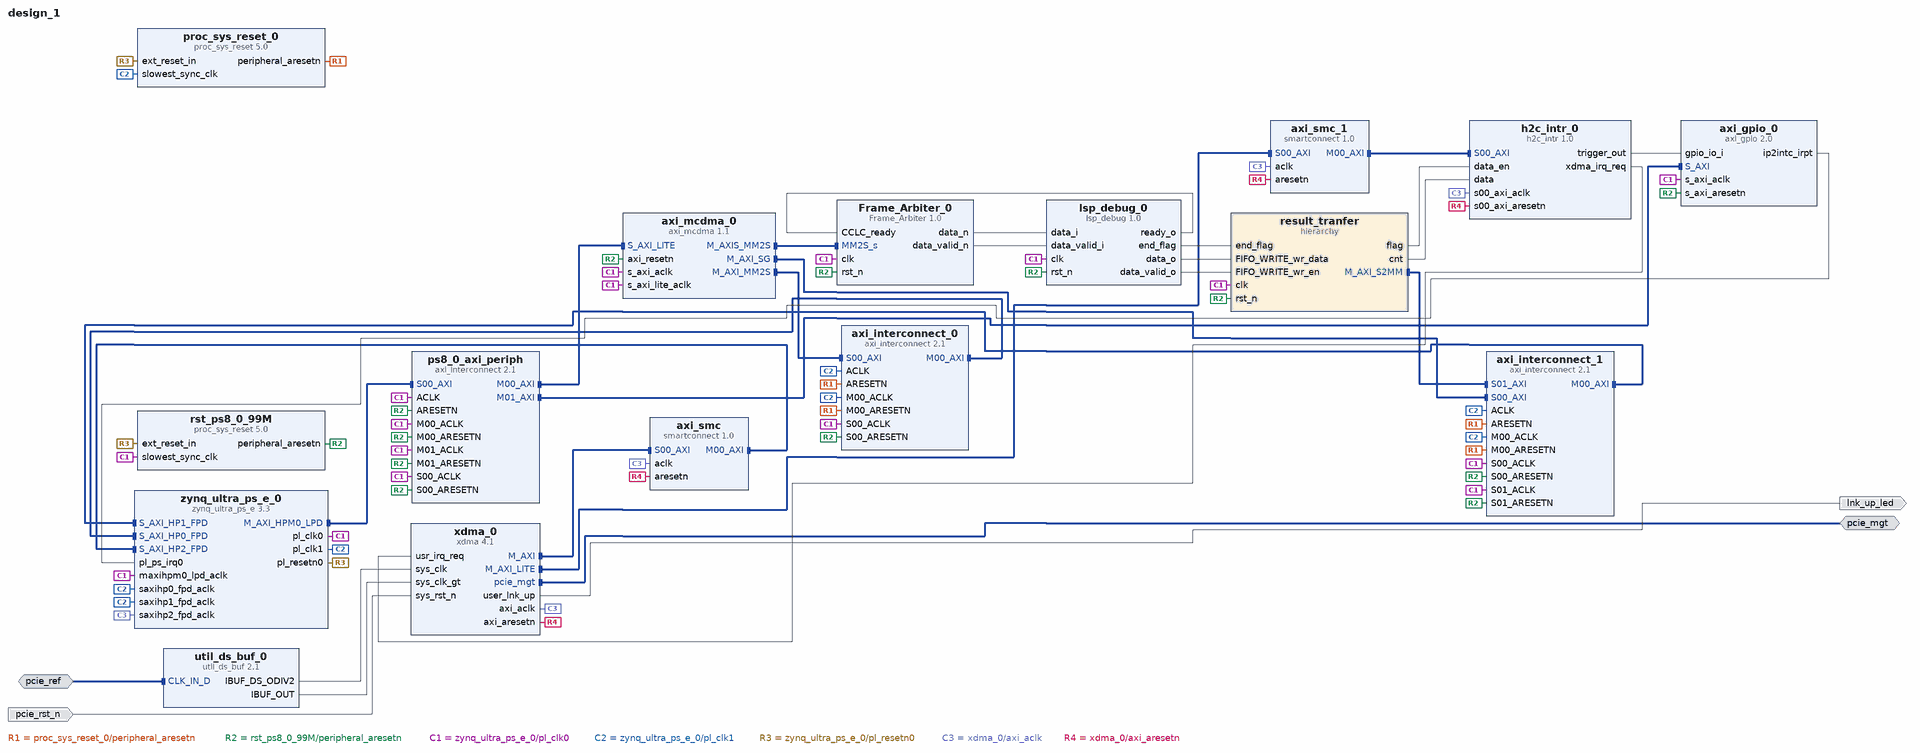
[diagram p0: block diagram of the top level]
# Vivado block design design_1, xczu4ev-sfvc784-2-i, Vivado 2020.2
create_bd_design design_1

create_bd_intf_port -mode Slave -vlnv xilinx.com:interface:diff_clock_rtl:1.0 pcie_ref
create_bd_intf_port -mode Master -vlnv xilinx.com:interface:pcie_7x_mgt_rtl:1.0 pcie_mgt
create_bd_port -dir I -type rst pcie_rst_n
create_bd_port -dir O lnk_up_led

create_bd_cell -type ip -vlnv xilinx.com:user:Frame_Arbiter:1.0 Frame_Arbiter_0
set_property -dict {CONFIG.channel_num 10} [get_bd_cells Frame_Arbiter_0]
create_bd_cell -type ip -vlnv xilinx.com:ip:axi_gpio:2.0 axi_gpio_0
set_property -dict [list \
  CONFIG.C_ALL_INPUTS 1 \
  CONFIG.C_ALL_INPUTS_2 0 \
  CONFIG.C_ALL_OUTPUTS_2 1 \
  CONFIG.C_GPIO2_WIDTH 1 \
  CONFIG.C_GPIO_WIDTH 1 \
  CONFIG.C_INTERRUPT_PRESENT 1 \
  CONFIG.C_IS_DUAL 1 \
] [get_bd_cells axi_gpio_0]
create_bd_cell -type ip -vlnv xilinx.com:ip:axi_interconnect:2.1 axi_interconnect_0
set_property -dict {CONFIG.NUM_MI 1 CONFIG.NUM_SI 1} [get_bd_cells axi_interconnect_0]
create_bd_cell -type ip -vlnv xilinx.com:ip:axi_interconnect:2.1 axi_interconnect_1
set_property -dict {CONFIG.NUM_MI 1 CONFIG.NUM_SI 2} [get_bd_cells axi_interconnect_1]
create_bd_cell -type ip -vlnv xilinx.com:ip:axi_mcdma:1.1 axi_mcdma_0
set_property -dict [list \
  CONFIG.c_group1_mm2s 0000001111111111 \
  CONFIG.c_include_s2mm 0 \
  CONFIG.c_m_axi_mm2s_data_width 256 \
  CONFIG.c_m_axis_mm2s_tdata_width 256 \
  CONFIG.c_mm2s_burst_size 32 \
  CONFIG.c_num_mm2s_channels 10 \
  CONFIG.c_sg_length_width 26 \
] [get_bd_cells axi_mcdma_0]
create_bd_cell -type ip -vlnv xilinx.com:user:lsp_debug:1.0 lsp_debug_0
set_property -dict {CONFIG.Height 582 CONFIG.Width 7680 CONFIG.merge_num 10} [get_bd_cells lsp_debug_0]
create_bd_cell -type ip -vlnv xilinx.com:ip:proc_sys_reset:5.0 proc_sys_reset_0
create_bd_cell -type ip -vlnv xilinx.com:ip:axi_interconnect:2.1 ps8_0_axi_periph
set_property -dict {CONFIG.NUM_MI 2} [get_bd_cells ps8_0_axi_periph]
create_bd_cell -type hier result_tranfer
create_bd_cell -type ip -vlnv xilinx.com:ip:proc_sys_reset:5.0 rst_ps8_0_99M
create_bd_cell -type ip -vlnv xilinx.com:ip:zynq_ultra_ps_e:3.3 zynq_ultra_ps_e_0
set_property -dict [list \
  CONFIG.PSU_BANK_0_IO_STANDARD LVCMOS18 \
  CONFIG.PSU_BANK_2_IO_STANDARD LVCMOS18 \
  CONFIG.PSU__CRF_APB__DDR_CTRL__FREQMHZ 1200 \
  CONFIG.PSU__CRF_APB__DDR_CTRL__SRCSEL DPLL \
  CONFIG.PSU__CRL_APB__PL0_REF_CTRL__FREQMHZ 200 \
  CONFIG.PSU__CRL_APB__PL0_REF_CTRL__SRCSEL IOPLL \
  CONFIG.PSU__CRL_APB__PL1_REF_CTRL__FREQMHZ 300 \
  CONFIG.PSU__CRL_APB__PL1_REF_CTRL__SRCSEL IOPLL \
  CONFIG.PSU__DDRC__BUS_WIDTH {64 Bit} \
  CONFIG.PSU__DDRC__COMPONENTS Components \
  CONFIG.PSU__DDRC__DEVICE_CAPACITY {8192 MBits} \
  CONFIG.PSU__DDRC__DRAM_WIDTH {16 Bits} \
  CONFIG.PSU__DDRC__ECC Disabled \
  CONFIG.PSU__DDRC__MEMORY_TYPE {DDR 4} \
  CONFIG.PSU__DDRC__SPEED_BIN DDR4_2400P \
  CONFIG.PSU__DDR_HIGH_ADDRESS_GUI_ENABLE 1 \
  CONFIG.PSU__DDR__INTERFACE__FREQMHZ 600.000 \
  CONFIG.PSU__FPGA_PL0_ENABLE 1 \
  CONFIG.PSU__FPGA_PL1_ENABLE 1 \
  CONFIG.PSU__UART0__BAUD_RATE 115200 \
  CONFIG.PSU__UART0__MODEM__ENABLE 0 \
  CONFIG.PSU__UART0__PERIPHERAL__ENABLE 1 \
  CONFIG.PSU__UART0__PERIPHERAL__IO {MIO 42 .. 43} \
  CONFIG.PSU__USE__IRQ0 1 \
  CONFIG.PSU__USE__S_AXI_GP2 1 \
  CONFIG.PSU__USE__S_AXI_GP3 1 \
  CONFIG.PSU__USE__S_AXI_GP4 1 \
  CONFIG.SUBPRESET1 Custom \
] [get_bd_cells zynq_ultra_ps_e_0]
# 66 more settings of zynq_ultra_ps_e_0 are not shown: defaults, MIO pin electricals, DDR timing, and values the tool derives
create_bd_cell -type ip -vlnv xilinx.com:ip:xdma:4.1 xdma_0
set_property -dict [list \
  CONFIG.PF0_DEVICE_ID_mqdma 9032 \
  CONFIG.PF2_DEVICE_ID_mqdma 9032 \
  CONFIG.PF3_DEVICE_ID_mqdma 9032 \
  CONFIG.axi_data_width 64_bit \
  CONFIG.axil_master_64bit_en false \
  CONFIG.axilite_master_en true \
  CONFIG.axisten_freq 250 \
  CONFIG.cfg_mgmt_if false \
  CONFIG.pcie_blk_locn X0Y1 \
  CONFIG.pciebar2axibar_axil_master 0x40000000 \
  CONFIG.pf0_device_id 9032 \
  CONFIG.pf0_interrupt_pin NONE \
  CONFIG.pf0_msix_cap_pba_bir BAR_1 \
  CONFIG.pf0_msix_cap_pba_offset 00008FE0 \
  CONFIG.pf0_msix_cap_table_bir BAR_1 \
  CONFIG.pf0_msix_cap_table_offset 00008000 \
  CONFIG.pf0_msix_cap_table_size 01F \
  CONFIG.pf0_msix_enabled true \
  CONFIG.pl_link_cap_max_link_speed 8.0_GT/s \
  CONFIG.pl_link_cap_max_link_width X2 \
  CONFIG.plltype QPLL1 \
  CONFIG.xdma_num_usr_irq 4 \
  CONFIG.xdma_pcie_64bit_en false \
  CONFIG.xdma_rnum_chnl 4 \
  CONFIG.xdma_wnum_chnl 4 \
] [get_bd_cells xdma_0]
create_bd_cell -type ip -vlnv xilinx.com:ip:smartconnect:1.0 axi_smc
set_property -dict {CONFIG.NUM_SI 1} [get_bd_cells axi_smc]
create_bd_cell -type ip -vlnv xilinx.com:ip:smartconnect:1.0 axi_smc_1
set_property -dict {CONFIG.NUM_SI 1} [get_bd_cells axi_smc_1]
create_bd_cell -type ip -vlnv xilinx.com:ip:util_ds_buf:2.1 util_ds_buf_0
set_property -dict {CONFIG.C_BUF_TYPE IBUFDSGTE} [get_bd_cells util_ds_buf_0]
create_bd_cell -type ip -vlnv xilinx.com:user:h2c_intr:1.0 h2c_intr_0

# ---- hierarchy /result_tranfer ----
current_bd_instance /result_tranfer
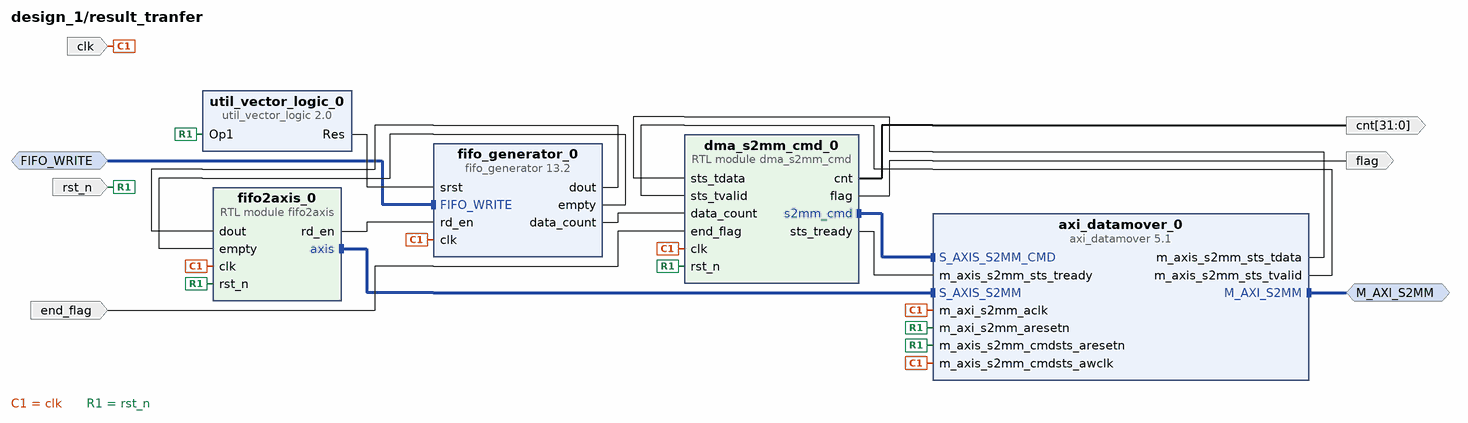
[diagram p1: block diagram inside /result_tranfer]
create_bd_intf_pin -mode Slave -vlnv xilinx.com:interface:fifo_write_rtl:1.0 FIFO_WRITE
create_bd_intf_pin -mode Master -vlnv xilinx.com:interface:aximm_rtl:1.0 M_AXI_S2MM
create_bd_pin -dir I -type clk clk
create_bd_pin -dir I end_flag
create_bd_pin -dir I -type rst rst_n
create_bd_pin -dir O -from 31 -to 0 cnt
create_bd_pin -dir O flag

create_bd_cell -type ip -vlnv xilinx.com:ip:axi_datamover:5.1 axi_datamover_0
set_property -dict [list \
  CONFIG.c_dummy 1 \
  CONFIG.c_enable_mm2s 0 \
  CONFIG.c_m_axi_s2mm_data_width 128 \
  CONFIG.c_s2mm_btt_used 23 \
  CONFIG.c_s2mm_burst_size 32 \
  CONFIG.c_s_axis_s2mm_tdata_width 128 \
] [get_bd_cells axi_datamover_0]
create_bd_cell -type module -reference fifo2axis fifo2axis_0
create_bd_cell -type ip -vlnv xilinx.com:ip:fifo_generator:13.2 fifo_generator_0
set_property -dict [list \
  CONFIG.Data_Count true \
  CONFIG.Data_Count_Width 8 \
  CONFIG.Fifo_Implementation Common_Clock_Block_RAM \
  CONFIG.Input_Data_Width 80 \
  CONFIG.Input_Depth 128 \
  CONFIG.Performance_Options First_Word_Fall_Through \
  CONFIG.Use_Embedded_Registers false \
] [get_bd_cells fifo_generator_0]
create_bd_cell -type ip -vlnv xilinx.com:ip:util_vector_logic:2.0 util_vector_logic_0
set_property -dict {CONFIG.C_OPERATION not CONFIG.C_SIZE 1} [get_bd_cells util_vector_logic_0]
create_bd_cell -type module -reference dma_s2mm_cmd dma_s2mm_cmd_0
set_property -dict {CONFIG.TAG {"0001"}} [get_bd_cells dma_s2mm_cmd_0]

# ---- connections ----

current_bd_instance /result_tranfer
connect_bd_intf_net [get_bd_intf_pins M_AXI_S2MM] [get_bd_intf_pins axi_datamover_0/M_AXI_S2MM]
connect_bd_intf_net [get_bd_intf_pins axi_datamover_0/S_AXIS_S2MM_CMD] [get_bd_intf_pins dma_s2mm_cmd_0/s2mm_cmd]
connect_bd_intf_net [get_bd_intf_pins FIFO_WRITE] [get_bd_intf_pins fifo_generator_0/FIFO_WRITE]
connect_bd_intf_net [get_bd_intf_pins axi_datamover_0/S_AXIS_S2MM] [get_bd_intf_pins fifo2axis_0/axis]
connect_bd_net [get_bd_pins axi_datamover_0/m_axis_s2mm_sts_tdata] [get_bd_pins dma_s2mm_cmd_0/sts_tdata]
connect_bd_net [get_bd_pins axi_datamover_0/m_axis_s2mm_sts_tvalid] [get_bd_pins dma_s2mm_cmd_0/sts_tvalid]
connect_bd_net -net clk_0_1 [get_bd_pins clk] \
  [get_bd_pins axi_datamover_0/m_axi_s2mm_aclk] [get_bd_pins axi_datamover_0/m_axis_s2mm_cmdsts_awclk] \
  [get_bd_pins fifo2axis_0/clk] [get_bd_pins fifo_generator_0/clk] [get_bd_pins dma_s2mm_cmd_0/clk]
connect_bd_net [get_bd_pins dma_s2mm_cmd_0/sts_tready] [get_bd_pins axi_datamover_0/m_axis_s2mm_sts_tready]
connect_bd_net -net end_flag_0_1 [get_bd_pins end_flag] [get_bd_pins dma_s2mm_cmd_0/end_flag]
connect_bd_net [get_bd_pins fifo2axis_0/rd_en] [get_bd_pins fifo_generator_0/rd_en]
connect_bd_net [get_bd_pins fifo_generator_0/data_count] [get_bd_pins dma_s2mm_cmd_0/data_count]
connect_bd_net [get_bd_pins fifo_generator_0/dout] [get_bd_pins fifo2axis_0/dout]
connect_bd_net [get_bd_pins fifo_generator_0/empty] [get_bd_pins fifo2axis_0/empty]
connect_bd_net [get_bd_pins rst_n] \
  [get_bd_pins axi_datamover_0/m_axi_s2mm_aresetn] [get_bd_pins axi_datamover_0/m_axis_s2mm_cmdsts_aresetn] \
  [get_bd_pins fifo2axis_0/rst_n] [get_bd_pins util_vector_logic_0/Op1] [get_bd_pins dma_s2mm_cmd_0/rst_n]
connect_bd_net [get_bd_pins util_vector_logic_0/Res] [get_bd_pins fifo_generator_0/srst]
connect_bd_net [get_bd_pins dma_s2mm_cmd_0/cnt] [get_bd_pins cnt]
connect_bd_net [get_bd_pins dma_s2mm_cmd_0/flag] [get_bd_pins flag]

current_bd_instance /
connect_bd_intf_net [get_bd_intf_pins axi_interconnect_1/M00_AXI] [get_bd_intf_pins zynq_ultra_ps_e_0/S_AXI_HP1_FPD]
connect_bd_intf_net [get_bd_intf_pins axi_interconnect_0/S00_AXI] [get_bd_intf_pins axi_mcdma_0/M_AXI_MM2S]
connect_bd_intf_net [get_bd_intf_pins axi_interconnect_1/S00_AXI] [get_bd_intf_pins axi_mcdma_0/M_AXI_SG]
connect_bd_intf_net -intf_net CLK_IN_D_0_1 [get_bd_intf_ports pcie_ref] [get_bd_intf_pins util_ds_buf_0/CLK_IN_D]
connect_bd_intf_net [get_bd_intf_pins axi_gpio_0/S_AXI] [get_bd_intf_pins ps8_0_axi_periph/M01_AXI]
connect_bd_intf_net [get_bd_intf_pins xdma_0/M_AXI] [get_bd_intf_pins axi_smc/S00_AXI]
connect_bd_intf_net [get_bd_intf_pins xdma_0/M_AXI_LITE] [get_bd_intf_pins axi_smc_1/S00_AXI]
connect_bd_intf_net [get_bd_intf_pins result_tranfer/M_AXI_S2MM] [get_bd_intf_pins axi_interconnect_1/S01_AXI]
connect_bd_intf_net [get_bd_intf_ports pcie_mgt] [get_bd_intf_pins xdma_0/pcie_mgt]
connect_bd_intf_net [get_bd_intf_pins axi_smc_1/M00_AXI] [get_bd_intf_pins h2c_intr_0/S00_AXI]
connect_bd_intf_net [get_bd_intf_pins ps8_0_axi_periph/S00_AXI] [get_bd_intf_pins zynq_ultra_ps_e_0/M_AXI_HPM0_LPD]
connect_bd_intf_net [get_bd_intf_pins Frame_Arbiter_0/MM2S_s] [get_bd_intf_pins axi_mcdma_0/M_AXIS_MM2S]
connect_bd_intf_net [get_bd_intf_pins axi_interconnect_0/M00_AXI] [get_bd_intf_pins zynq_ultra_ps_e_0/S_AXI_HP0_FPD]
connect_bd_intf_net [get_bd_intf_pins axi_mcdma_0/S_AXI_LITE] [get_bd_intf_pins ps8_0_axi_periph/M00_AXI]
connect_bd_intf_net [get_bd_intf_pins axi_smc/M00_AXI] [get_bd_intf_pins zynq_ultra_ps_e_0/S_AXI_HP2_FPD]
connect_bd_net -net ARESETN_1 [get_bd_pins proc_sys_reset_0/peripheral_aresetn] \
  [get_bd_pins axi_interconnect_0/ARESETN] [get_bd_pins axi_interconnect_0/M00_ARESETN] \
  [get_bd_pins axi_interconnect_1/ARESETN] [get_bd_pins axi_interconnect_1/M00_ARESETN]
connect_bd_net [get_bd_pins Frame_Arbiter_0/data_n] [get_bd_pins lsp_debug_0/data_i]
connect_bd_net [get_bd_pins Frame_Arbiter_0/data_valid_n] [get_bd_pins lsp_debug_0/data_valid_i]
connect_bd_net [get_bd_pins axi_gpio_0/ip2intc_irpt] [get_bd_pins zynq_ultra_ps_e_0/pl_ps_irq0]
connect_bd_net -net light_spot_positioni_0_end_flag [get_bd_pins lsp_debug_0/end_flag] [get_bd_pins result_tranfer/end_flag]
connect_bd_net -net light_spot_positioni_0_ready_o [get_bd_pins lsp_debug_0/ready_o] [get_bd_pins Frame_Arbiter_0/CCLC_ready]
connect_bd_net [get_bd_pins lsp_debug_0/data_o] [get_bd_pins result_tranfer/FIFO_WRITE_wr_data]
connect_bd_net [get_bd_pins lsp_debug_0/data_valid_o] [get_bd_pins result_tranfer/FIFO_WRITE_wr_en]
connect_bd_net [get_bd_pins rst_ps8_0_99M/peripheral_aresetn] \
  [get_bd_pins Frame_Arbiter_0/rst_n] [get_bd_pins axi_gpio_0/s_axi_aresetn] [get_bd_pins axi_interconnect_0/S00_ARESETN] \
  [get_bd_pins axi_interconnect_1/S00_ARESETN] [get_bd_pins axi_mcdma_0/axi_resetn] [get_bd_pins lsp_debug_0/rst_n] \
  [get_bd_pins ps8_0_axi_periph/ARESETN] [get_bd_pins ps8_0_axi_periph/M00_ARESETN] \
  [get_bd_pins ps8_0_axi_periph/M01_ARESETN] [get_bd_pins ps8_0_axi_periph/S00_ARESETN] [get_bd_pins result_tranfer/rst_n] \
  [get_bd_pins axi_interconnect_1/S01_ARESETN]
connect_bd_net [get_bd_pins zynq_ultra_ps_e_0/pl_clk0] \
  [get_bd_pins Frame_Arbiter_0/clk] [get_bd_pins axi_gpio_0/s_axi_aclk] [get_bd_pins axi_interconnect_0/S00_ACLK] \
  [get_bd_pins axi_interconnect_1/S00_ACLK] [get_bd_pins axi_mcdma_0/s_axi_aclk] [get_bd_pins axi_mcdma_0/s_axi_lite_aclk] \
  [get_bd_pins lsp_debug_0/clk] [get_bd_pins ps8_0_axi_periph/ACLK] [get_bd_pins ps8_0_axi_periph/M00_ACLK] \
  [get_bd_pins ps8_0_axi_periph/M01_ACLK] [get_bd_pins ps8_0_axi_periph/S00_ACLK] [get_bd_pins result_tranfer/clk] \
  [get_bd_pins rst_ps8_0_99M/slowest_sync_clk] [get_bd_pins zynq_ultra_ps_e_0/maxihpm0_lpd_aclk] \
  [get_bd_pins axi_interconnect_1/S01_ACLK]
connect_bd_net [get_bd_pins zynq_ultra_ps_e_0/pl_clk1] \
  [get_bd_pins axi_interconnect_0/ACLK] [get_bd_pins axi_interconnect_0/M00_ACLK] [get_bd_pins axi_interconnect_1/ACLK] \
  [get_bd_pins axi_interconnect_1/M00_ACLK] [get_bd_pins proc_sys_reset_0/slowest_sync_clk] \
  [get_bd_pins zynq_ultra_ps_e_0/saxihp0_fpd_aclk] [get_bd_pins zynq_ultra_ps_e_0/saxihp1_fpd_aclk]
connect_bd_net [get_bd_pins zynq_ultra_ps_e_0/pl_resetn0] [get_bd_pins proc_sys_reset_0/ext_reset_in] [get_bd_pins rst_ps8_0_99M/ext_reset_in]
connect_bd_net [get_bd_pins xdma_0/axi_aclk] \
  [get_bd_pins axi_smc/aclk] [get_bd_pins zynq_ultra_ps_e_0/saxihp2_fpd_aclk] [get_bd_pins axi_smc_1/aclk] \
  [get_bd_pins h2c_intr_0/s00_axi_aclk]
connect_bd_net [get_bd_pins xdma_0/axi_aresetn] [get_bd_pins axi_smc/aresetn] [get_bd_pins axi_smc_1/aresetn] [get_bd_pins h2c_intr_0/s00_axi_aresetn]
connect_bd_net [get_bd_pins util_ds_buf_0/IBUF_DS_ODIV2] [get_bd_pins xdma_0/sys_clk]
connect_bd_net [get_bd_pins util_ds_buf_0/IBUF_OUT] [get_bd_pins xdma_0/sys_clk_gt]
connect_bd_net -net sys_rst_n_0_1 [get_bd_ports pcie_rst_n] [get_bd_pins xdma_0/sys_rst_n]
connect_bd_net [get_bd_pins xdma_0/user_lnk_up] [get_bd_ports lnk_up_led]
connect_bd_net [get_bd_pins result_tranfer/flag] [get_bd_pins h2c_intr_0/data_en]
connect_bd_net [get_bd_pins h2c_intr_0/trigger_out] [get_bd_pins axi_gpio_0/gpio_io_i]
connect_bd_net [get_bd_pins h2c_intr_0/xdma_irq_req] [get_bd_pins xdma_0/usr_irq_req]
connect_bd_net [get_bd_pins result_tranfer/cnt] [get_bd_pins h2c_intr_0/data]

# ---- address map ----
assign_bd_address -offset 0x00000000 -range 2G -target_address_space [get_bd_addr_spaces axi_mcdma_0/Data_MM2S] [get_bd_addr_segs zynq_ultra_ps_e_0/SAXIGP2/HP0_DDR_LOW]
exclude_bd_addr_seg -offset 0xFF000000 -range 16M -target_address_space [get_bd_addr_spaces axi_mcdma_0/Data_MM2S] [get_bd_addr_segs zynq_ultra_ps_e_0/SAXIGP2/HP0_LPS_OCM]
exclude_bd_addr_seg -offset 0x800000000 -range 4G -target_address_space [get_bd_addr_spaces axi_mcdma_0/Data_MM2S] [get_bd_addr_segs zynq_ultra_ps_e_0/SAXIGP2/HP0_DDR_HIGH]
assign_bd_address -offset 0x00000000 -range 2G -target_address_space [get_bd_addr_spaces axi_mcdma_0/Data_SG] [get_bd_addr_segs zynq_ultra_ps_e_0/SAXIGP3/HP1_DDR_LOW]
exclude_bd_addr_seg -offset 0xFF000000 -range 16M -target_address_space [get_bd_addr_spaces axi_mcdma_0/Data_SG] [get_bd_addr_segs zynq_ultra_ps_e_0/SAXIGP3/HP1_LPS_OCM]
exclude_bd_addr_seg -offset 0x800000000 -range 4G -target_address_space [get_bd_addr_spaces axi_mcdma_0/Data_SG] [get_bd_addr_segs zynq_ultra_ps_e_0/SAXIGP3/HP1_DDR_HIGH]
assign_bd_address -offset 0x00000000 -range 2G -target_address_space [get_bd_addr_spaces result_tranfer/axi_datamover_0/Data_S2MM] [get_bd_addr_segs zynq_ultra_ps_e_0/SAXIGP3/HP1_DDR_LOW]
exclude_bd_addr_seg -offset 0xFF000000 -range 16M -target_address_space [get_bd_addr_spaces result_tranfer/axi_datamover_0/Data_S2MM] [get_bd_addr_segs zynq_ultra_ps_e_0/SAXIGP3/HP1_LPS_OCM]
exclude_bd_addr_seg -offset 0x800000000 -range 4G -target_address_space [get_bd_addr_spaces result_tranfer/axi_datamover_0/Data_S2MM] [get_bd_addr_segs zynq_ultra_ps_e_0/SAXIGP3/HP1_DDR_HIGH]
assign_bd_address -offset 0x0000000000000000 -range 2G -target_address_space [get_bd_addr_spaces xdma_0/M_AXI] [get_bd_addr_segs zynq_ultra_ps_e_0/SAXIGP4/HP2_DDR_LOW]
assign_bd_address -offset 0x00000000FF000000 -range 16M -target_address_space [get_bd_addr_spaces xdma_0/M_AXI] [get_bd_addr_segs zynq_ultra_ps_e_0/SAXIGP4/HP2_LPS_OCM]
assign_bd_address -offset 0x0000000800000000 -range 32G -target_address_space [get_bd_addr_spaces xdma_0/M_AXI] [get_bd_addr_segs zynq_ultra_ps_e_0/SAXIGP4/HP2_DDR_HIGH]
assign_bd_address -offset 0x44A00000 -range 64K -target_address_space [get_bd_addr_spaces xdma_0/M_AXI_LITE] [get_bd_addr_segs h2c_intr_0/S00_AXI/S00_AXI_reg]
assign_bd_address -offset 0x0080000000 -range 64K -target_address_space [get_bd_addr_spaces zynq_ultra_ps_e_0/Data] [get_bd_addr_segs axi_mcdma_0/S_AXI_LITE/Reg]
assign_bd_address -offset 0x0080010000 -range 64K -target_address_space [get_bd_addr_spaces zynq_ultra_ps_e_0/Data] [get_bd_addr_segs axi_gpio_0/S_AXI/Reg]

validate_bd_design
save_bd_design
